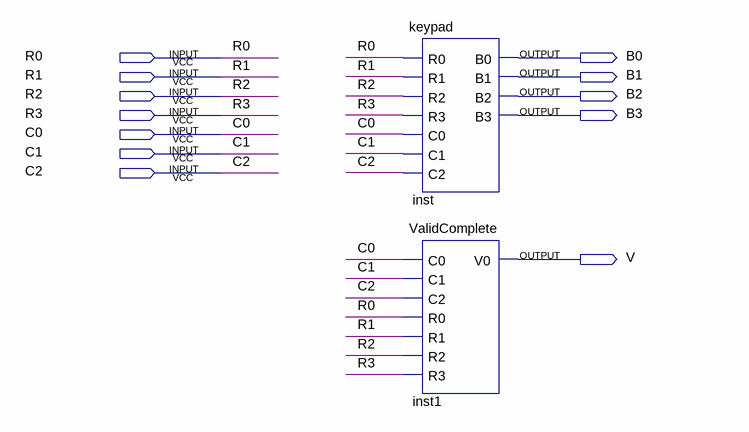
[diagram p0: schematic sheet]
// Quartus schematic panel.bdf as structural Verilog: 2 symbols, 12 pins
module panel (
  input  R0,
  input  R1,
  input  R2,
  input  R3,
  input  C0,
  input  C1,
  input  C2,
  output B0,
  output B1,
  output B2,
  output B3,
  output V
);

  keypad inst (.R0(R0), .R1(R1), .R2(R2), .R3(R3), .C0(C0), .C1(C1), .C2(C2), .B0(B0), .B1(B1), .B2(B2), .B3(B3));
  ValidComplete inst1 (.C0(C0), .C1(C1), .C2(C2), .R0(R0), .R1(R1), .R2(R2), .R3(R3), .V0(V));
endmodule
